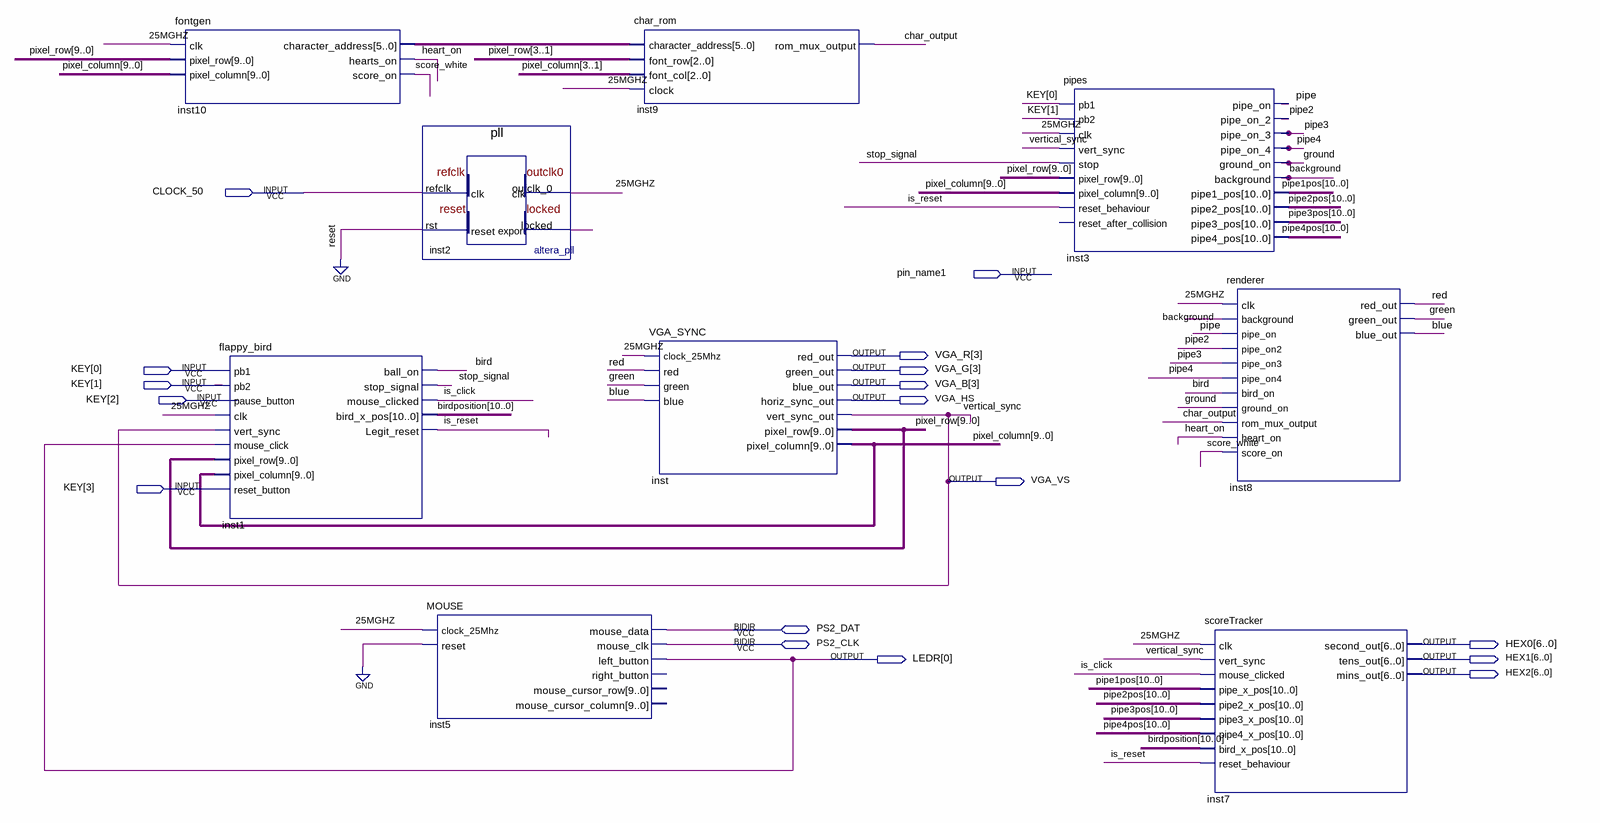
[diagram p0: schematic sheet]
// Quartus schematic FlappyBird.bdf as structural Verilog: 9 symbols, 17 pins
module FlappyBird (
  input  CLOCK_50,
  input  pin_name1,
  input  [3:0] KEY,
  inout  PS2_DAT,
  inout  PS2_CLK,
  output [3:3] VGA_R,
  output [3:3] VGA_G,
  output [3:3] VGA_B,
  output VGA_HS,
  output VGA_VS,
  output [6:0] HEX0,
  output [0:0] LEDR,
  output [6:0] HEX1,
  output [6:0] HEX2
);

  wire \25MGHZ , background, bird, blue, char_output, green, ground, heart_on, inst2_locked, is_click,
       is_reset, pipe, pipe2, pipe3, pipe4, red, score_white, stop_signal;
  wire [5:0] inst10_character_address;
  wire [9:0] pixel_column, pixel_row;
  wire [10:0] birdposition, pipe1pos, pipe2pos, pipe3pos, pipe4pos;

  fontgen inst10 (
    .clk(\25MGHZ ), .pixel_row(pixel_row), .pixel_column(pixel_column),
    .character_address(inst10_character_address), .hearts_on(heart_on), .score_on(score_white));
  flappy_bird inst1 (
    .pb2(KEY[1]), .pause_button(KEY[2]), .clk(\25MGHZ ), .vert_sync(VGA_VS), .mouse_click(LEDR[0]),
    .pixel_row(pixel_row), .pixel_column(pixel_column), .reset_button(KEY[3]), .ball_on(bird),
    .stop_signal(stop_signal), .mouse_clicked(is_click), .bird_x_pos(birdposition), .Legit_reset(is_reset));  // open: pb1
  pll inst2 (.refclk(CLOCK_50), .rst(1'b0), .outclk_0(\25MGHZ ), .locked(inst2_locked));
  MOUSE inst5 (
    .clock_25Mhz(\25MGHZ ), .reset(1'b0), .left_button(LEDR[0]), .mouse_data(PS2_DAT), .mouse_clk(PS2_CLK));  // open: right_button, mouse_cursor_row, mouse_cursor_column
  char_rom inst9 (
    .character_address(inst10_character_address), .font_row(pixel_row[3:1]), .font_col(pixel_column[3:1]),
    .clock(\25MGHZ ), .rom_mux_output(char_output));
  VGA_SYNC inst (
    .clock_25Mhz(\25MGHZ ), .red(red), .green(green), .blue(blue), .red_out(VGA_R[3]), .green_out(VGA_G[3]),
    .blue_out(VGA_B[3]), .horiz_sync_out(VGA_HS), .vert_sync_out(VGA_VS), .pixel_row(pixel_row),
    .pixel_column(pixel_column));
  pipes inst3 (
    .pb1(KEY[0]), .pb2(KEY[1]), .clk(\25MGHZ ), .vert_sync(VGA_VS), .stop(stop_signal),
    .pixel_row(pixel_row), .pixel_column(pixel_column), .reset_behaviour(is_reset), .pipe_on(pipe),
    .pipe_on_2(pipe2), .pipe_on_3(pipe3), .pipe_on_4(pipe4), .ground_on(ground), .background(background),
    .pipe1_pos(pipe1pos), .pipe2_pos(pipe2pos), .pipe3_pos(pipe3pos), .pipe4_pos(pipe4pos));  // open: reset_after_collision
  scoreTracker inst7 (
    .clk(\25MGHZ ), .vert_sync(VGA_VS), .mouse_clicked(is_click), .pipe_x_pos(pipe1pos),
    .pipe2_x_pos(pipe2pos), .pipe3_x_pos(pipe3pos), .pipe4_x_pos(pipe4pos), .bird_x_pos(birdposition),
    .reset_behaviour(is_reset), .second_out(HEX0), .tens_out(HEX1), .mins_out(HEX2));
  renderer inst8 (
    .clk(\25MGHZ ), .background(background), .pipe_on(pipe), .pipe_on2(pipe2), .pipe_on3(pipe3),
    .pipe_on4(pipe4), .bird_on(bird), .ground_on(ground), .rom_mux_output(char_output), .heart_on(heart_on),
    .score_on(score_white), .red_out(red), .green_out(green), .blue_out(blue));

  // Other names for the same wires on the sheet: vertical_sync = VGA_VS
endmodule
